# EAGLE schematic processing (EAGLE 9.2.0)
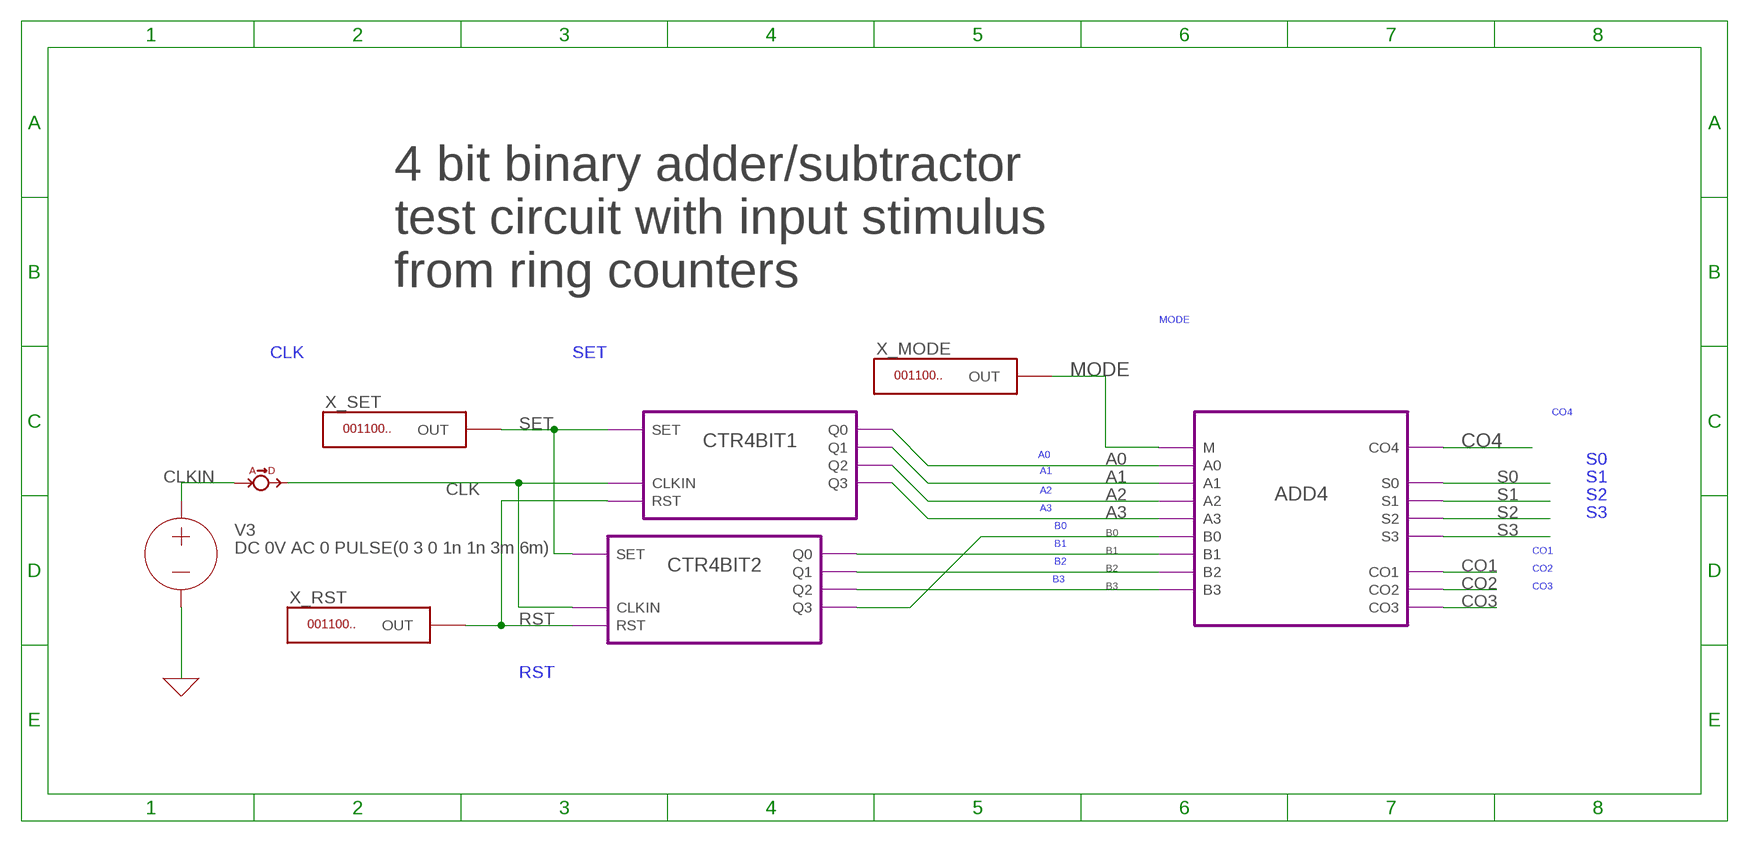
[diagram p0: schematic, sheet 1]

## Parts
V3  DC 0V AC 0 PULSE(0 3 0 1n 1n 3m 6m)  VOLTAGE  (no package)
X3  ATODB  (no package)
X_MODE  DIGSRC  (no package)
X_RST  DIGSRC  (no package)
X_SET  DIGSRC  (no package)

## Module instances
ADD4 = ADD4
CTR4BIT1 = CTR4BIT
CTR4BIT2 = CTR4BIT

## Nets
0: V3.- ; supply symbol labelled GND
A0: port ADD4.A0 CTR4BIT1.Q0
A1: port ADD4.A1 CTR4BIT1.Q1
A2: port ADD4.A2 CTR4BIT1.Q2
A3: port ADD4.A3 CTR4BIT1.Q3
B0: port CTR4BIT2.Q3 ADD4.B0
B1: port CTR4BIT2.Q0 ADD4.B1
B2: port CTR4BIT2.Q1 ADD4.B2
B3: port CTR4BIT2.Q2 ADD4.B3
CLK: X3.DIG ; port CTR4BIT1.CLKIN CTR4BIT2.CLKIN
CLKIN: V3.+ X3.AN
CO1: port ADD4.CO1
CO2: port ADD4.CO2
CO3: port ADD4.CO3
CO4: port ADD4.CO4
MODE: X_MODE.OUT ; port ADD4.M
RST: X_RST.OUT ; port CTR4BIT1.RST CTR4BIT2.RST
S0: port ADD4.S0
S1: port ADD4.S1
S2: port ADD4.S2
S3: port ADD4.S3
SET: X_SET.OUT ; port CTR4BIT1.SET CTR4BIT2.SET

## Notes on the sheet
- 4 bit binary adder/subtractor
  test circuit with input stimulus
  from ring counters

## Library data of the parts
V3 = ngspice-simulation:VOLTAGE: Independent Voltage Source, either DC, AC, PULSE, SINE, PWL, EXP, or SFFM; SPICEPREFIX: V; VALUE: 0V
X3 = ngspice-digital:ATODB: Analog to digital bridge; SPICEPREFIX: X
X_MODE = ngspice-digital:DIGSRC: 1 output digital (file) source; EAGLE_DIGITAL_SOURCE_FILE: driverd1_1.dsource.txt; SPICEMODEL: DRIVERD1_1; SPICEPREFIX: X
X_RST = ngspice-digital:DIGSRC: 1 output digital (file) source; EAGLE_DIGITAL_SOURCE_FILE: driverd1_4.dsource.txt; SPICEMODEL: DRIVERD1_4; SPICEPREFIX: X
X_SET = ngspice-digital:DIGSRC: 1 output digital (file) source; EAGLE_DIGITAL_SOURCE_FILE: driverd1_5.dsource.txt; SPICEMODEL: DRIVERD1_5; SPICEPREFIX: X

## Module ADDER1BIT
Ports: A(in) B(in) CIN(in) COUT(out) S(out)
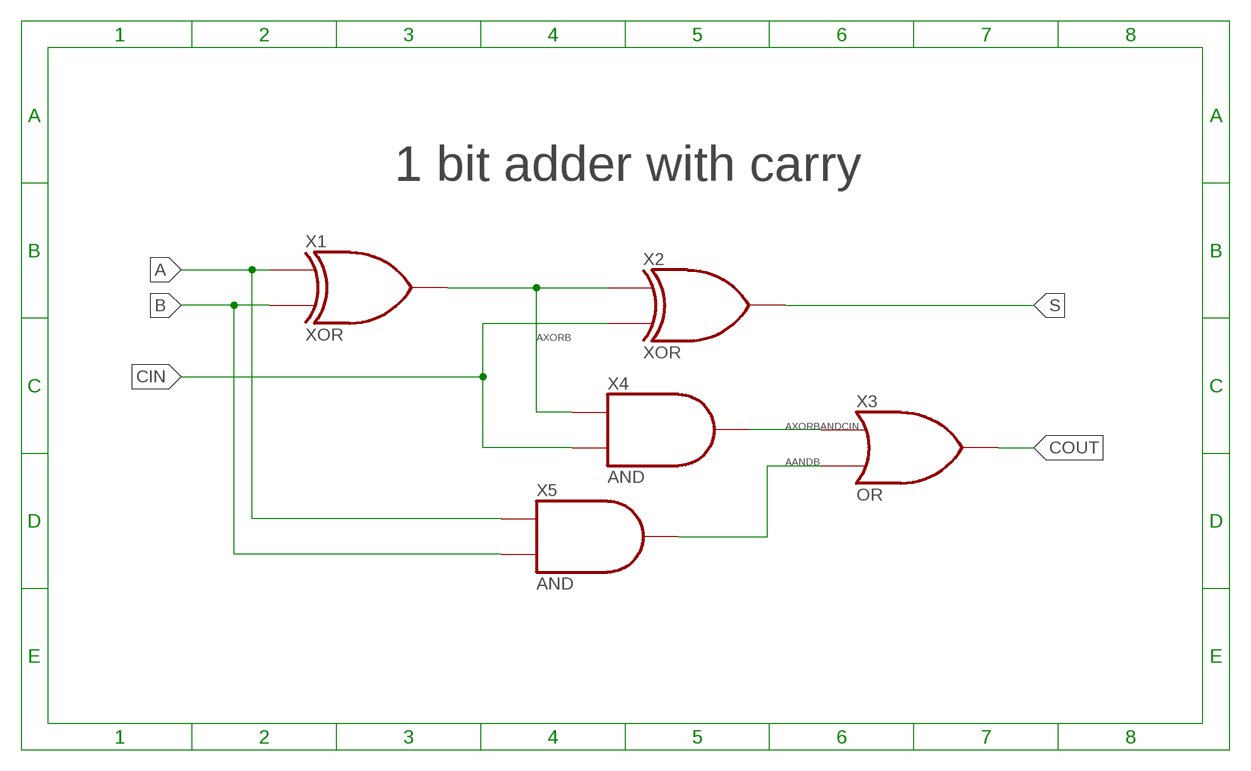
[diagram p1: schematic, module ADDER1BIT, sheet 1]

### Parts
X1  XOR  (no package)
X2  XOR  (no package)
X3  OR  (no package)
X4  AND  (no package)
X5  AND  (no package)

### Nets
A: X1.A X5.A
AANDB: X3.B X5.Y
AXORB: X1.Y X2.A X4.A
AXORBANDCIN: X3.A X4.Y
B: X1.B X5.B
CIN: X2.B X4.B
COUT: X3.Y
S: X2.Y

### Notes on the sheet
- 1 bit adder with carry

### Library data of the parts
X1 X2 = ngspice-digital:XOR: 2 input XOR gate
X3 = ngspice-digital:OR: 2 input logic OR gate
X4 X5 = ngspice-digital:AND: 2 input logic AND gate

## Module ADD4
Ports: A0(io) A1(io) A2(io) A3(io) B0(io) B2(io) B1(io) B3(io) S0(io) S1(io) S2(io) S3(io) M(io) CO4(io) CO1(io) CO2(io) CO3(io)
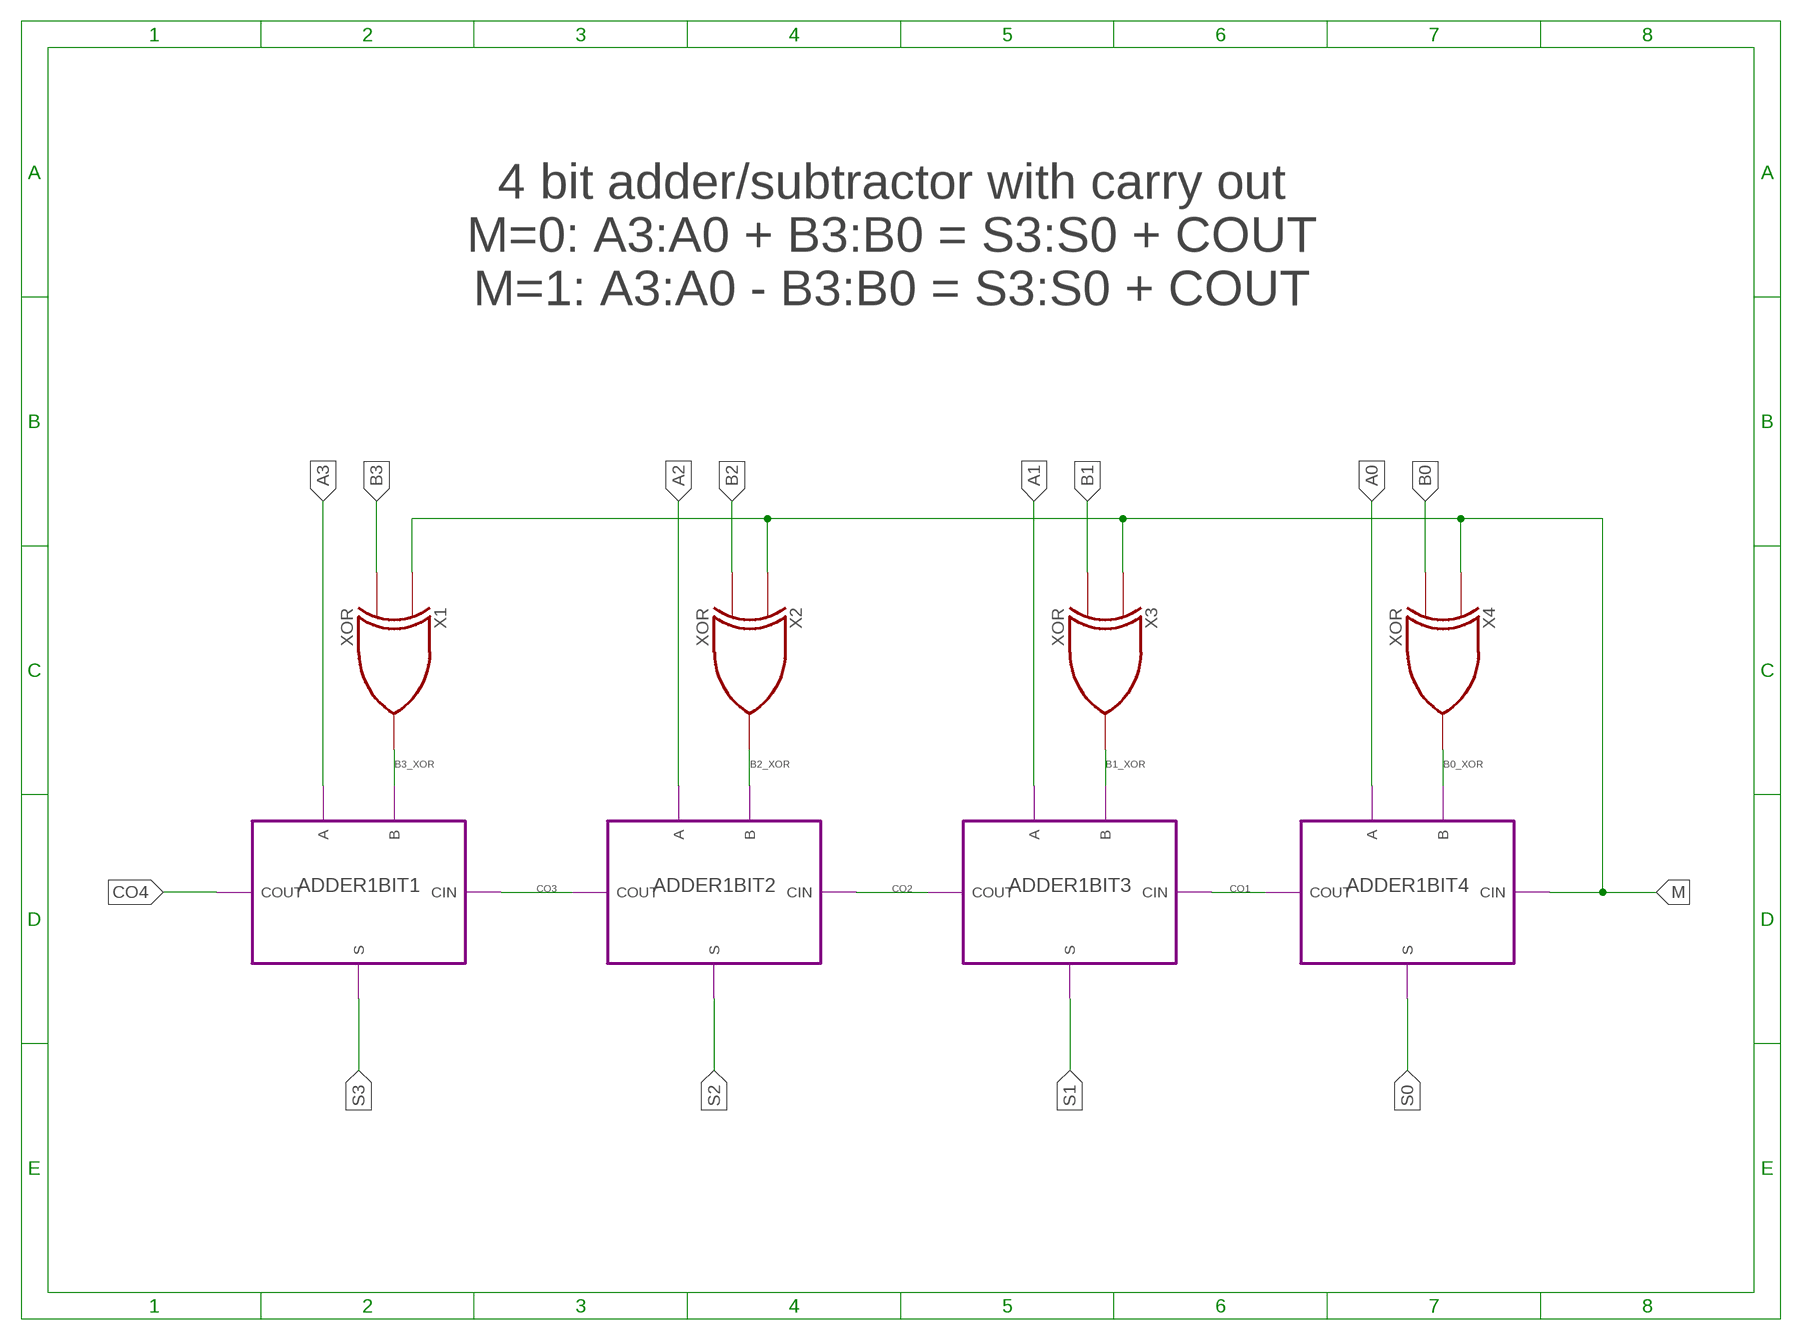
[diagram p2: schematic, module ADD4, sheet 1]

### Parts
X1  XOR  (no package)
X2  XOR  (no package)
X3  XOR  (no package)
X4  XOR  (no package)

### Module instances
ADDER1BIT1 = ADDER1BIT
ADDER1BIT2 = ADDER1BIT
ADDER1BIT3 = ADDER1BIT
ADDER1BIT4 = ADDER1BIT

### Nets
A0: port ADDER1BIT4.A
A1: port ADDER1BIT3.A
A2: port ADDER1BIT2.A
A3: port ADDER1BIT1.A
B0: X4.B
B0_XOR: X4.Y ; port ADDER1BIT4.B
B1: X3.B
B1_XOR: X3.Y ; port ADDER1BIT3.B
B2: X2.B
B2_XOR: X2.Y ; port ADDER1BIT2.B
B3: X1.B
B3_XOR: X1.Y ; port ADDER1BIT1.B
CO1: port ADDER1BIT3.CIN ADDER1BIT4.COUT
CO2: port ADDER1BIT2.CIN ADDER1BIT3.COUT
CO3: port ADDER1BIT1.CIN ADDER1BIT2.COUT
CO4: port ADDER1BIT1.COUT
M: X1.A X2.A X3.A X4.A ; port ADDER1BIT4.CIN
S0: port ADDER1BIT4.S
S1: port ADDER1BIT3.S
S2: port ADDER1BIT2.S
S3: port ADDER1BIT1.S

### Notes on the sheet
- 4 bit adder/subtractor with carry out
  M=0: A3:A0 + B3:B0 = S3:S0 + COUT
  M=1: A3:A0 - B3:B0 = S3:S0 + COUT

### Library data of the parts
X1-X4 = ngspice-digital:XOR: 2 input XOR gate

## Module CTR4BIT
Ports: Q0(out) Q1(out) Q2(out) Q3(out) RST(in) CLKIN(in) SET(in)
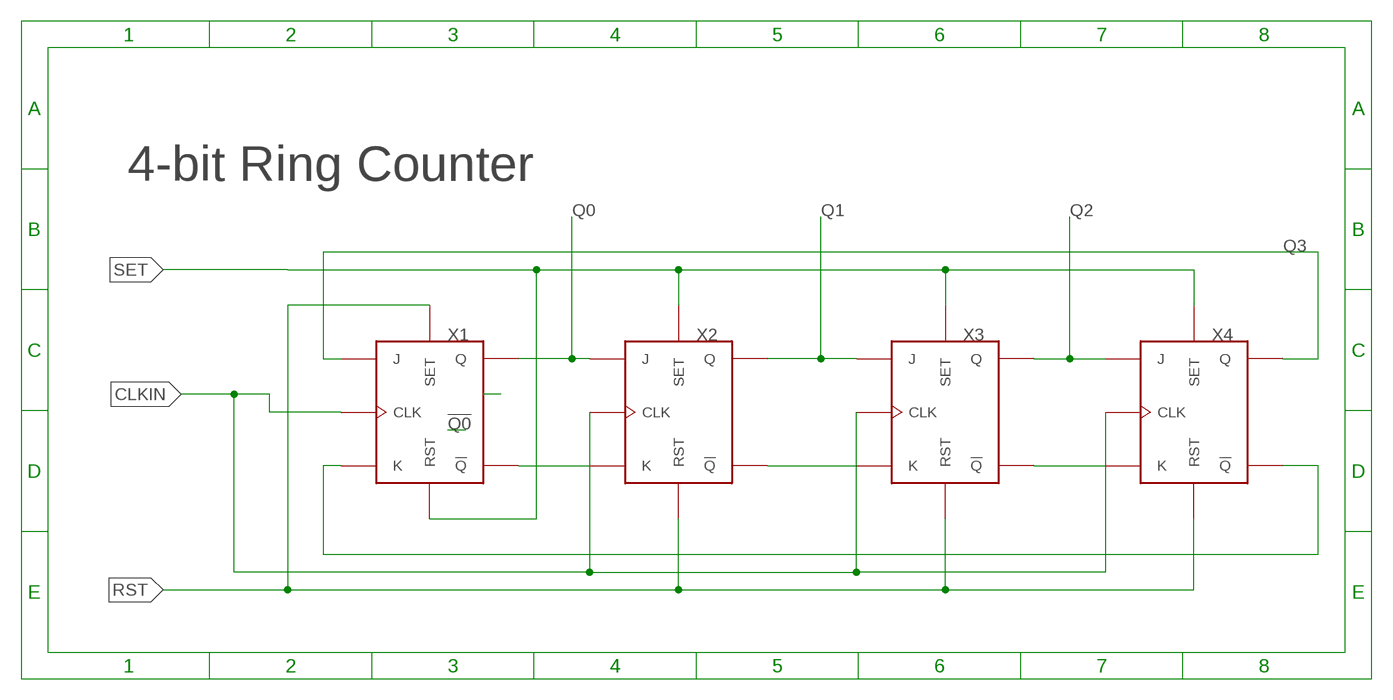
[diagram p3: schematic, module CTR4BIT, sheet 1]

### Parts
X1  JKFF  (no package)
X2  JKFF  (no package)
X3  JKFF  (no package)
X4  JKFF  (no package)

### Nets
CLKIN: X1.CLK X2.CLK X3.CLK X4.CLK
N$5: X1.!Q X2.K
N$6: X2.!Q X3.K
N$7: X3.!Q X4.K
N$9: X1.K X4.!Q
Q0: X1.Q X2.J
Q1: X2.Q X3.J
Q2: X3.Q X4.J
Q3: X1.J X4.Q
RST: X1.SET X2.RST X3.RST X4.RST
SET: X1.RST X2.SET X3.SET X4.SET

### Notes on the sheet
- 4-bit Ring Counter

### Library data of the parts
X1-X4 = ngspice-digital:JKFF: JK TYPE FLIP FLOP